# EAGLE design mainboard-opti (EAGLE 5.10)
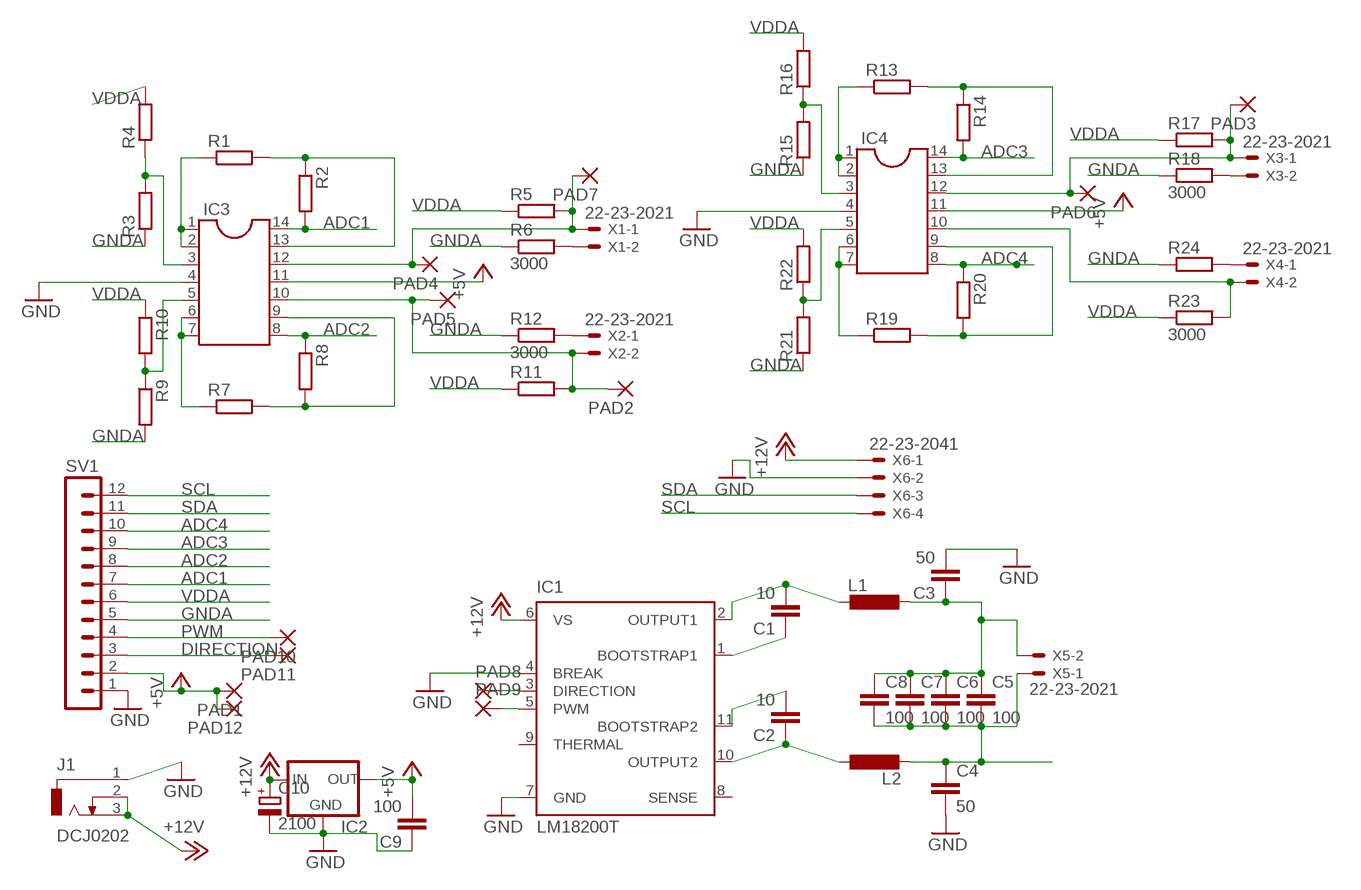
[diagram p0: schematic, sheet 1]

## Parts
C1  10  C-EU050-025X075  [C050-025X075]
C2  10  C-EU050-025X075  [C050-025X075]
C3  50  C-EU050-025X075  [C050-025X075]
C4  50  C-EU050-025X075  [C050-025X075]
C5  100  C-EU050-025X075  [C050-025X075]
C6  100  C-EU050-025X075  [C050-025X075]
C7  100  C-EU050-025X075  [C050-025X075]
C8  100  C-EU050-025X075  [C050-025X075]
C9  100  C-EU050-025X075  [C050-025X075]
C10  2100  CPOL-EUE2.5-7  [E2,5-7]
IC1  LM18200T  [TO-220-11]
IC2  78XXS  [78XXS]
IC3  DIL14  [DIL14]
IC4  DIL14  [DIL14]
J1  DCJ0202  [DCJ0202]
L1  LMURATA  [LCUSTMURATA]
L2  LMURATA  [LCUSTMURATA]
PAD1  1,6/0,8  [1,6/0,8]
PAD2  1,6/0,8  [1,6/0,8]
PAD3  1,6/0,8  [1,6/0,8]
PAD4  1,6/0,8  [1,6/0,8]
PAD5  1,6/0,8  [1,6/0,8]
PAD6  1,6/0,8  [1,6/0,8]
PAD7  1,6/0,8  [1,6/0,8]
PAD8  1,6/0,8  [1,6/0,8]
PAD9  1,6/0,8  [1,6/0,8]
PAD10  1,6/0,8  [1,6/0,8]
PAD11  1,6/0,8  [1,6/0,8]
PAD12  1,6/0,8  [1,6/0,8]
R1  R-EU_0207/10  [0207/10]
R2  R-EU_0207/10  [0207/10]
R3  R-EU_0207/10  [0207/10]
R4  R-EU_0207/10  [0207/10]
R5  R-EU_0207/10  [0207/10]
R6  3000  R-EU_0207/10  [0207/10]
R7  R-EU_0207/10  [0207/10]
R8  R-EU_0207/10  [0207/10]
R9  R-EU_0207/10  [0207/10]
R10  R-EU_0207/10  [0207/10]
R11  R-EU_0207/10  [0207/10]
R12  3000  R-EU_0207/10  [0207/10]
R13  R-EU_0207/10  [0207/10]
R14  R-EU_0207/10  [0207/10]
R15  R-EU_0207/10  [0207/10]
R16  R-EU_0207/10  [0207/10]
R17  R-EU_0207/10  [0207/10]
R18  3000  R-EU_0207/10  [0207/10]
R19  R-EU_0207/10  [0207/10]
R20  R-EU_0207/10  [0207/10]
R21  R-EU_0207/10  [0207/10]
R22  R-EU_0207/10  [0207/10]
R23  3000  R-EU_0207/10  [0207/10]
R24  R-EU_0207/10  [0207/10]
SV1  MA12-1W  [MA12-1W]
X1  22-23-2021  [22-23-2021]
X2  22-23-2021  [22-23-2021]
X3  22-23-2021  [22-23-2021]
X4  22-23-2021  [22-23-2021]
X5  22-23-2021  [22-23-2021]
X6  22-23-2041  [22-23-2041]

## Nets
+5V: C9.2 IC2.OUT IC3.11 IC4.11 PAD1.1(P) PAD12.1(P) SV1.2
+12V: C10.+ IC1.6(VS) IC2.IN J1.2 J1.3 X6.1
ADC1: IC3.14 R2.2 SV1.7
ADC2: IC3.8 R8.1 SV1.8
ADC3: IC4.14 R14.2 SV1.9
ADC4: IC4.8 R20.1 SV1.10
DIRECTION: IC1.3(DIRECTION) PAD8.1(P) PAD11.1(P) SV1.3
GND: C3.2 C4.2 C9.1 C10.- IC1.4(BREAK) IC1.7(GND) IC2.GND IC3.4 IC4.4 J1.1 SV1.1 X6.2
GNDA: R3.1 R6.1 R9.2 R12.1 R15.1 R18.1 R21.1 R24.1 SV1.5
N$1: C1.1 IC1.1(BOOTSTRAP1)
N$2: C1.2 IC1.2(OUTPUT1) L1.2
N$3: IC3.3 R3.2 R4.1
N$5: C2.2 IC1.11(BOOTSTRAP2)
N$6: C2.1 IC1.10(OUTPUT2) L2.1
N$7: C4.1 C5.2 C6.2 C7.2 C8.2 L2.2 X5.1
N$8: IC3.1 IC3.2 R1.1
N$9: R24.2 X4.1
N$10: IC3.13 R1.2 R2.1
N$11: R6.2 X1.2
N$12: IC4.1 IC4.2 R13.1
N$13: IC4.13 R13.2 R14.1
N$14: IC3.9 R7.2 R8.2
N$15: IC3.6 IC3.7 R7.1
N$16: IC3.12 PAD4.1(P) PAD7.1(P) R5.2 X1.1
N$17: IC4.3 R15.2 R16.1
N$18: IC3.5 R9.1 R10.2
N$19: R12.2 X2.1
N$20: R18.2 X3.2
N$21: IC4.12 PAD3.1(P) PAD6.1(P) R17.2 X3.1
N$23: IC4.9 R19.2 R20.2
N$24: IC4.6 IC4.7 R19.1
N$25: IC4.5 R21.2 R22.1
N$26: IC3.10 PAD2.1(P) PAD5.1(P) R11.2 X2.2
N$27: IC4.10 R23.2 X4.2
N$30: C3.1 C5.1 C6.1 C7.1 C8.1 L1.1 X5.2
PWM: IC1.5(PWM) PAD9.1(P) PAD10.1(P) SV1.4
SCL: SV1.12 X6.4
SDA: SV1.11 X6.3
VDDA: R4.2 R5.1 R10.1 R11.1 R16.2 R17.1 R22.2 R23.1 SV1.6
Unconnected: IC1.8(SENSE) IC1.9(THERMAL)

## Library data of the parts
C1-C9 = resistor:C-EU: CAPACITOR, European symbol
C10 = rcl:CPOL-EU: POLARIZED CAPACITOR, European symbol
IC1 = national-semiconductor:LM18200T: 3A, 55V H-Bridge Motor Control SourcE: http://cache.national.com/ds/LM/LMD18200.pdf
IC2 = v-reg:78XXS: VOLTAGE REGULATOR
IC3 IC4 = ic-package:DIL14: Dual In Line / Socket
J1 = con-jack:DCJ0202: DC POWER JACK Source: DCJ0202.pdf
L1 L2 = custom:LMURATA
PAD1-PAD12 = wirepad:1,6/0,8: THROUGH-HOLE PAD
R1-R24 = resistor:R-EU_: RESISTOR, European symbol
SV1 = con-lstb:MA12-1W: PIN HEADER
X1-X5 = con-molex:22-23-2021: .100" (2.54mm) Center Header - 2 Pin
X6 = con-molex:22-23-2041: .100" (2.54mm) Center Header - 4 Pin

## Board
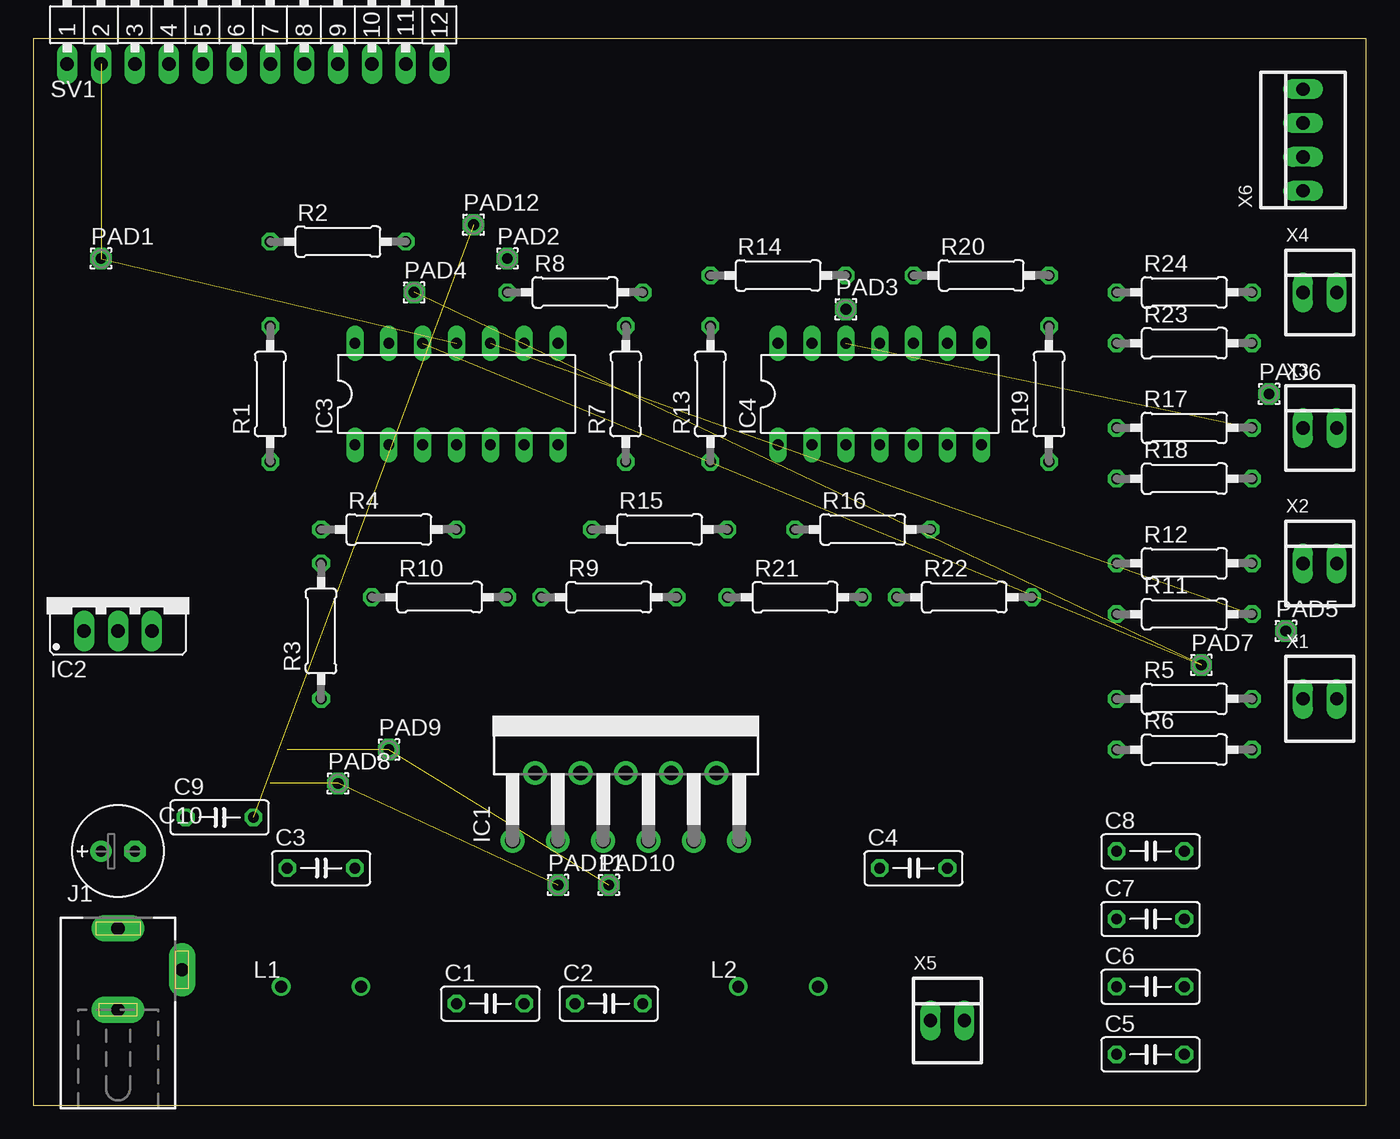
[diagram p1: board, top side]
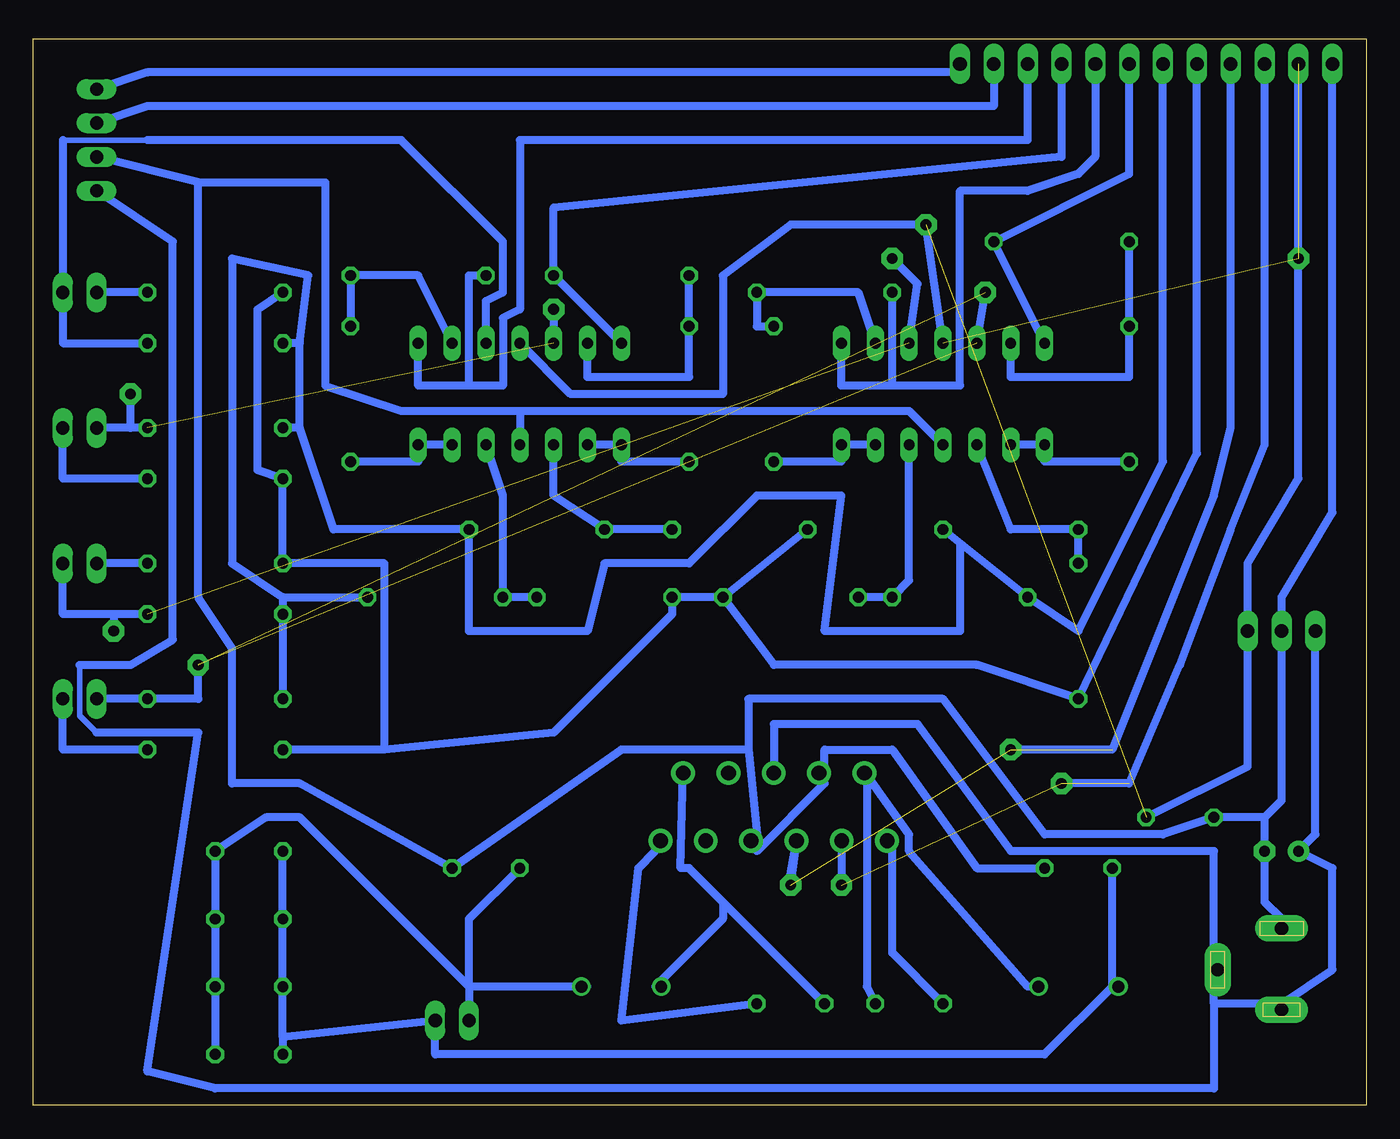
[diagram p2: board, bottom side, seen from below]

Size 100 x 80 mm. Coordinates in mm from the lower left corner, seen from the top.
Outline: 0,0 100,0 100,80 0,80 0,0
Copper layers 16: Bottom 0.035mm
Design rules "default *": minimum track width 14mil, minimum drill 24mil, track to track 12mil, track to pad 12mil, pad to pad 12mil, via to via 12mil, smd to smd 8mil, copper to edge 40mil, drill to drill 8mil, minimum pad ring 10mil, minimum via ring 8mil, stop-mask expansion 4mil, vias tented up to drill 0mil, thermal gap 10mil

### Footprints (pad centres in the part's own frame; a part is rotated, then mirrored left to right if it is on the bottom)
C050-025X075 = drill 0.813 octagon: 1 -2.54,0; 2 2.54,0
E2,5-7 = drill 0.813 pad 1.6 round: + -1.27,0 | drill 0.813 pad 1.6 octagon: - 1.27,0
TO-220-11 = drill 1.1 pad 1.778 round: 1 -8.5,-9.37; 2 -6.8,-4.29; 3 -5.1,-9.37; 4 -3.4,-4.29; 5 -1.7,-9.37; 6 0,-4.29; 7 1.7,-9.37; 8 3.4,-4.29; 9 5.1,-9.37; 10 6.8,-4.29; 11 8.5,-9.37
78XXS = drill 1.016 long: GND 0,-2.54; IN -2.54,-2.54; OUT 2.54,-2.54
DIL14 = drill 0.813 long: 1 -7.62,-3.81; 2 -5.08,-3.81; 3 -2.54,-3.81; 4 0,-3.81; 5 2.54,-3.81; 6 5.08,-3.81; 7 7.62,-3.81; 8 7.62,3.81; 9 5.08,3.81; 10 2.54,3.81; 11 0,3.81; 12 -2.54,3.81; 13 -5.08,3.81; 14 -7.62,3.81
DCJ0202 = drill 1 pad 2 long: 1 0,3.1; 2 4.8,0; 3 0,-3
LCUSTMURATA = drill 0.889 round: 1 -2.997,0; 2 2.997,0
1,6/0,8 = drill 0.813 pad 1.6 octagon: 1 0,0
0207/10 = drill 0.813 octagon: 1 -5.08,0; 2 5.08,0
MA12-1W = drill 1.016 long: 1 -13.97,0; 2 -11.43,0; 3 -8.89,0; 4 -6.35,0; 5 -3.81,0; 6 -1.27,0; 7 1.27,0; 8 3.81,0; 9 6.35,0; 10 8.89,0; 11 11.43,0; 12 13.97,0
22-23-2021 = drill 1 long: 1 -1.27,0; 2 1.27,0
22-23-2041 = drill 1 long: 1 -3.81,0; 2 -1.27,0; 3 1.27,0; 4 3.81,0

### Placement (x,y rotation side)
C1  34.29,7.62 0 top
C2  43.18,7.62 0 top
C3  21.59,17.78 0 top
C4  66.04,17.78 0 top
C5  83.82,3.81 0 top
C6  83.82,8.89 0 top
C7  83.82,13.97 0 top
C8  83.82,19.05 0 top
C9  13.97,21.59 0 top
C10  6.35,19.05 0 top
IC1  44.45,29.21 0 top
IC2  6.35,38.1 0 top
IC3  31.75,53.34 0 top
IC4  63.5,53.34 0 top
J1  6.35,10.16 0 top
L1  21.59,8.89 0 top
L2  55.88,8.89 0 top
PAD1  5.08,63.5 0 top
PAD2  35.56,63.5 0 top
PAD3  60.96,59.69 0 top
PAD4  28.57,60.96 0 top
PAD5  93.98,35.56 0 top
PAD6  92.71,53.34 0 top
PAD7  87.63,33.02 0 top
PAD8  22.86,24.13 0 top
PAD9  26.67,26.67 0 top
PAD10  43.18,16.51 0 top
PAD11  39.37,16.51 0 top
PAD12  33.02,66.04 0 top
R1  17.78,53.34 90 top
R2  22.86,64.77 0 top
R3  21.59,35.56 90 top
R4  26.67,43.18 0 top
R5  86.36,30.48 0 top
R6  86.36,26.67 0 top
R7  44.45,53.34 90 top
R8  40.64,60.96 0 top
R9  43.18,38.1 0 top
R10  30.48,38.1 0 top
R11  86.36,36.83 0 top
R12  86.36,40.64 0 top
R13  50.8,53.34 90 top
R14  55.88,62.23 0 top
R15  46.99,43.18 0 top
R16  62.23,43.18 0 top
R17  86.36,50.8 0 top
R18  86.36,46.99 0 top
R19  76.2,53.34 90 top
R20  71.12,62.23 0 top
R21  57.15,38.1 0 top
R22  69.85,38.1 0 top
R23  86.36,57.15 0 top
R24  86.36,60.96 0 top
SV1  16.51,78.11 0 top
X1  96.52,30.48 0 top
X2  96.52,40.64 0 top
X3  96.52,50.8 0 top
X4  96.52,60.96 0 top
X5  68.58,6.35 0 top
X6  95.25,72.39 90 top

### Tracks (layer width: path | path; a pad name or v marks a point on that pad's centre or on a via)
+5V  (3 unrouted)
  Bottom 0.61: IC3.11 PAD12.1 43.18,66.04 48.26,62.23 48.26,53.34 59.69,53.34 IC4.11 | C9.2 8.89,25.4 IC2.OUT 8.89,40.64 5.08,46.99 SV1.2
+12V
  Bottom 0.406: 96.52,33.02 96.52,29.21 95.25,27.94
  Bottom 0.61: IC2.IN 3.81,20.32 C10.+ 2.54,17.78 2.54,10.16 6.35,7.62 | X6.1 89.53,64.77 89.53,34.92 92.71,33.02 96.52,33.02 | 95.25,27.94 87.63,27.94 91.44,2.54 86.36,1.27 11.43,1.27 11.43,7.62 | 11.43,7.62 11.43,10.16 | 11.43,10.16 11.43,19.05 26.67,19.05 33.66,28.57 44.45,28.57 IC1.6 | 11.43,10.16 J1.2 | 6.35,7.62 11.43,7.62 | J1.3 6.35,7.62
ADC1
  Bottom 0.61: IC3.14 R2.2 17.78,69.85 SV1.7
ADC2
  Bottom 0.61: 35.56,53.98 R8.1 | 35.56,53.98 39.37,53.98 IC3.8 | 35.56,53.98 30.48,53.98 30.48,68.58 25.4,68.58 21.59,69.85 20.32,71.12 SV1.8
ADC3
  Bottom 0.61: IC4.14 R14.2 60.96,67.31 22.86,71.12 SV1.9
ADC4
  Bottom 0.61: 66.67,62.23 R20.1 67.31,62.23 67.31,53.98 | SV1.10 25.4,72.39 63.5,72.39 63.5,59.69 64.77,59.05 64.77,53.98 67.31,53.98 | 67.31,53.98 71.12,53.98 IC4.8
DIRECTION  (3 unrouted)
  Bottom 0.61: SV1.3 7.62,49.53 10.16,43.18 13.97,33.02 17.78,24.13 PAD8.1 | IC1.3 39.37,19.84 PAD11.1
GND
  Bottom 0.61: 7.62,21.59 C9.1 15.24,20.32 24.13,20.32 31.75,30.48 46.35,30.48 46.35,26.67 | 7.62,21.59 C10.- 7.62,15.24 6.35,13.97 J1.1 | 7.62,21.59 6.35,22.86 IC2.GND 6.35,38.1 2.54,44.45 SV1.1 | C3.2 29.21,17.78 35.56,26.67 40.64,26.67 40.64,25.4 IC1.4 40.64,24.13 45.72,19.05 IC1.7 45.72,20.32 46.35,26.67 | 46.35,26.67 55.88,26.67 C4.2 80.01,24.13 85.09,24.13 85.09,34.29 87.63,38.1 87.63,69.22 | IC3.4 34.29,52.07 63.5,52.07 | 63.5,52.07 IC4.4 | 87.63,69.22 78.11,69.22 78.11,53.98 72.39,52.07 63.5,52.07 | 87.63,69.22 X6.2
GNDA
  Bottom 0.61: R9.2 R21.1 52.07,36.83 60.96,27.94 73.66,26.67 | SV1.5 12.7,48.9 R3.1 29.21,33.02 44.45,33.02 R9.2 | R24.1 83.19,59.69 83.19,47.62 R18.1 R12.1 73.66,40.64 73.66,26.67 | 73.66,26.67 R6.1 | R9.2 R15.1
N$1
  Bottom 0.61: C1.1 35.56,11.43 35.56,19.05 IC1.1
N$2
  Bottom 0.61: C1.2 37.47,8.89 37.47,24.77 | 37.47,24.77 34.29,20.32 34.29,19.05 25.4,8.89 L1.2 | 37.47,24.77 IC1.2
N$3
  Bottom 0.61: IC3.3 26.67,43.18 R4.1 R3.2
N$5
  Bottom 0.61: C2.2 55.88,6.35 54.61,17.78 53.34,19.05 IC1.11
N$6
  Bottom 0.61: 48.26,15.24 50.8,17.78 51.44,17.78 IC1.10 | C2.1 48.26,15.24 | 48.26,15.24 48.26,13.97 53.34,8.89 L2.1
N$7
  Bottom 0.61: C5.2 C6.2 C7.2 C8.2 82.55,21.59 80.01,21.59 67.31,8.89 | C4.1 67.31,13.97 67.31,8.89 | 67.31,8.89 X5.1 | 67.31,8.89 L2.2 58.42,8.89
N$8
  Bottom 0.61: IC3.2 IC3.1 24.13,48.26 R1.1
N$9
  Bottom 0.61: R24.2 X4.1
N$10
  Bottom 0.61: R2.1 R1.2 17.78,54.61 26.67,54.61 IC3.13
N$11
  Bottom 0.61: R6.2 97.79,26.67 X1.2
N$12
  Bottom 0.61: R13.1 55.88,48.26 IC4.1 IC4.2
N$13
  Bottom 0.61: R14.1 R13.2 50.8,54.61 58.42,54.61 IC4.13
N$14
  Bottom 0.61: IC3.9 38.1,60.96 R8.2 45.72,58.42 R7.2
N$15
  Bottom 0.61: IC3.6 IC3.7 39.37,48.26 R7.1
N$16  (2 unrouted)
  Bottom 0.61: X1.1 R5.2 87.63,30.48 PAD7.1 | IC3.12 PAD4.1
N$17
  Bottom 0.61: R15.2 R16.1 60.96,45.72 IC4.3
N$18
  Bottom 0.61: R9.1 R10.2 34.29,39.37 IC3.5
N$19
  Bottom 0.61: R12.2 X2.1
N$20
  Bottom 0.61: R18.2 97.79,46.99 X3.2
N$21  (1 unrouted)
  Bottom 0.61: R17.2 92.71,50.8 | 92.71,50.8 X3.1 | 92.71,50.8 PAD6.1 | PAD3.1 IC4.12
N$23
  Bottom 0.61: IC4.9 71.12,62.23 R20.2 R19.2
N$24
  Bottom 0.61: IC4.6 IC4.7 71.12,48.26 R19.1
N$25
  Bottom 0.61: R21.2 R22.1 64.77,45.72 IC4.5
N$26  (1 unrouted)
  Bottom 0.61: R11.2 93.98,36.83 | 93.98,36.83 97.79,36.83 X2.2 | 93.98,36.83 PAD5.1 | IC3.10 33.66,61.59 PAD2.1
N$27
  Bottom 0.406: 91.44,72.39 97.79,72.39
  Bottom 0.61: IC4.10 66.04,60.33 64.77,60.96 64.77,64.77 72.39,72.39 91.44,72.39 | 97.79,72.39 X4.2 97.79,57.15 R23.2
N$30
  Bottom 0.61: 81.28,5.08 C5.1 | 81.28,5.08 C6.1 C7.1 C8.1 | 19.05,8.89 C3.1 | 81.28,5.08 X5.2 69.85,3.81 24.13,3.81 19.05,8.89 | L1.1 19.05,8.89
PWM  (3 unrouted)
  Bottom 0.61: SV1.4 10.16,50.8 11.43,45.72 19.05,26.67 PAD9.1 | 43.18,16.66 43.18,17.3 IC1.5 43.18,16.66 | 43.18,16.66 PAD10.1
SCL
  Bottom 0.61: X6.4 91.44,77.47 30.48,77.47 SV1.12
SDA
  Bottom 0.61: X6.3 91.44,74.93 27.94,74.93 SV1.11
VDDA
  Bottom 0.61: 30.36,42.06 R10.1 21.59,35.56 15.24,48.26 SV1.6 | 30.36,42.06 R4.2 | R5.1 R11.1 81.28,38.1 | 81.28,38.1 R22.2 | 80.01,50.8 77.47,43.18 R16.2 67.31,35.56 58.42,35.56 57.15,40.64 50.8,40.64 45.72,45.72 39.37,45.72 40.64,35.56 30.48,35.56 30.48,41.91 30.36,42.06 | 80.01,50.8 R17.1 | 81.28,38.1 85.09,40.64 85.09,63.5 79.38,62.23 80.01,57.15 | 80.01,50.8 80.01,57.15 | 80.01,57.15 R23.1